# EAGLE design io_uarts (EAGLE 5.11)
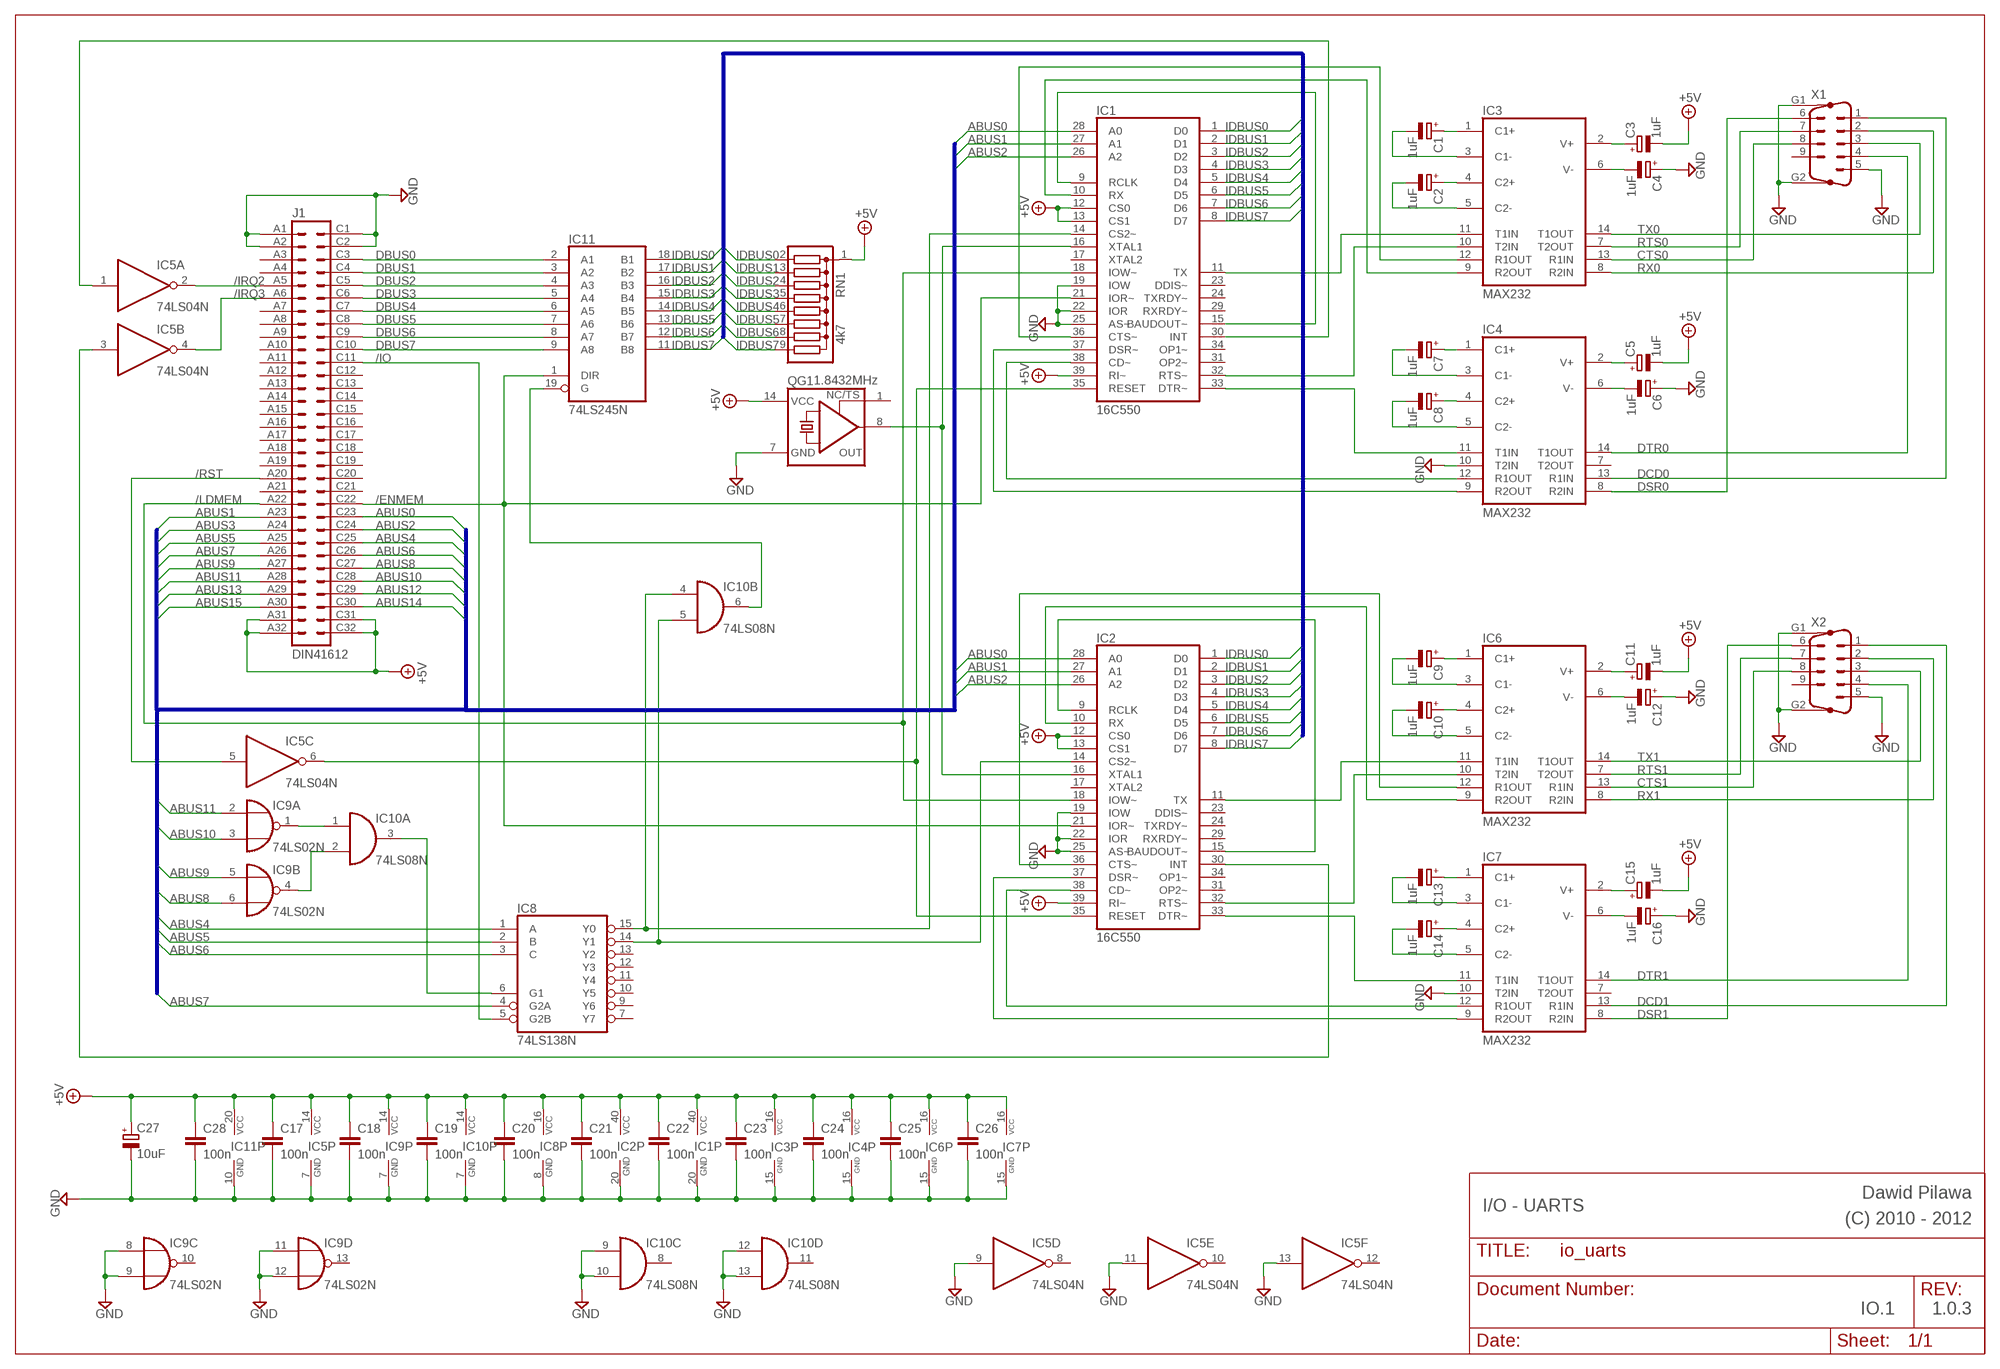
[diagram p0: schematic, sheet 1]

## Parts
C1  1uF  CPOL-EUE5-5  [E5-5]
C2  1uF  CPOL-EUE5-5  [E5-5]
C3  1uF  CPOL-EUE5-5  [E5-5]
C4  1uF  CPOL-EUE5-5  [E5-5]
C5  1uF  CPOL-EUE5-5  [E5-5]
C6  1uF  CPOL-EUE5-5  [E5-5]
C7  1uF  CPOL-EUE5-5  [E5-5]
C8  1uF  CPOL-EUE5-5  [E5-5]
C9  1uF  CPOL-EUE5-5  [E5-5]
C10  1uF  CPOL-EUE5-5  [E5-5]
C11  1uF  CPOL-EUE5-5  [E5-5]
C12  1uF  CPOL-EUE5-5  [E5-5]
C13  1uF  CPOL-EUE5-5  [E5-5]
C14  1uF  CPOL-EUE5-5  [E5-5]
C15  1uF  CPOL-EUE5-5  [E5-5]
C16  1uF  CPOL-EUE5-5  [E5-5]
C17  100n  C-EU050-024X044  [C050-024X044]
C18  100n  C-EU050-024X044  [C050-024X044]
C19  100n  C-EU050-024X044  [C050-024X044]
C20  100n  C-EU050-024X044  [C050-024X044]
C21  100n  C-EU050-024X044  [C050-024X044]
C22  100n  C-EU050-024X044  [C050-024X044]
C23  100n  C-EU050-024X044  [C050-024X044]
C24  100n  C-EU050-024X044  [C050-024X044]
C25  100n  C-EU050-024X044  [C050-024X044]
C26  100n  C-EU050-024X044  [C050-024X044]
C27  10uF  CPOL-EUE5-5  [E5-5]
C28  100n  C-EU050-024X044  [C050-024X044]
IC1  16C550  XR-16C550P  [DIL40]
IC2  16C550  XR-16C550P  [DIL40]
IC3  MAX232  [DIL16]
IC4  MAX232  [DIL16]
IC5  74LS04N  [DIL14]
IC6  MAX232  [DIL16]
IC7  MAX232  [DIL16]
IC8  74LS138N  [DIL16]
IC9  74LS02N  [DIL14]
IC10  74LS08N  [DIL14]
IC11  74LS245N  [DIL20]
J1  DIN41612  VG64B  [VG64B]
QG1  1.8432MHz  XO-14  [DIL14S]
RN1  4k7  G08R  [SIL9]
X1  M09HP  [M09HP]
X2  M09HP  [M09HP]

## Nets
+5V: C3.- C5.- C11.- C15.- C17.1 C18.1 C19.1 C20.1 C21.1 C22.1 C23.1 C24.1 C25.1 C26.1 C27.+ C28.1 IC1.12(CS0) IC1.13(CS1) IC1.39(RI~) IC1.40(VCC) IC2.12(CS0) IC2.13(CS1) IC2.39(RI~) IC2.40(VCC) IC3.16(VCC) IC4.16(VCC) IC5.14(P:VCC) IC6.16(VCC) IC7.16(VCC) IC8.16(VCC) IC9.14(P:VCC) IC10.14(P:VCC) IC11.20(VCC) J1.A31 J1.A32 J1.C31 J1.C32 QG1.14(VCC) RN1.1
/ENMEM: IC1.21(IOR~) IC2.21(IOR~) IC11.1(DIR) J1.C22
/IO: IC8.5(G2B) J1.C11
/IRQ2: IC5.2(A:O) J1.A5
/IRQ3: IC5.4(B:O) J1.A6
/LDMEM: IC1.18(IOW~) IC2.18(IOW~) J1.A22
/RST: IC5.5(C:I) J1.A20
ABUS0: IC1.28(A0) IC2.28(A0) J1.C23
ABUS1: IC1.27(A1) IC2.27(A1) J1.A23
ABUS2: IC1.26(A2) IC2.26(A2) J1.C24
ABUS3: J1.A24
ABUS4: IC8.1(A) J1.C25
ABUS5: IC8.2(B) J1.A25
ABUS6: IC8.3(C) J1.C26
ABUS7: IC8.4(G2A) J1.A26
ABUS8: IC9.6(B:I1) J1.C27
ABUS9: IC9.5(B:I0) J1.A27
ABUS10: IC9.3(A:I1) J1.C28
ABUS11: IC9.2(A:I0) J1.A28
ABUS12: J1.C29
ABUS13: J1.A29
ABUS14: J1.C30
ABUS15: J1.A30
CTS0: IC3.13(R1IN) X1.8
CTS1: IC6.13(R1IN) X2.8
DBUS0: IC11.2(A1) J1.C3
DBUS1: IC11.3(A2) J1.C4
DBUS2: IC11.4(A3) J1.C5
DBUS3: IC11.5(A4) J1.C6
DBUS4: IC11.6(A5) J1.C7
DBUS5: IC11.7(A6) J1.C8
DBUS6: IC11.8(A7) J1.C9
DBUS7: IC11.9(A8) J1.C10
DCD0: IC4.13(R1IN) X1.1
DCD1: IC7.13(R1IN) X2.1
DSR0: IC4.8(R2IN) X1.6
DSR1: IC7.8(R2IN) X2.6
DTR0: IC4.14(T1OUT) X1.4
DTR1: IC7.14(T1OUT) X2.4
GND: C4.+ C6.+ C12.+ C16.+ C17.2 C18.2 C19.2 C20.2 C21.2 C22.2 C23.2 C24.2 C25.2 C26.2 C27.- C28.2 IC1.19(IOW) IC1.20(GND) IC1.22(IOR) IC1.25(AS~) IC2.19(IOW) IC2.20(GND) IC2.22(IOR) IC2.25(AS~) IC3.15(GND) IC4.10(T2IN) IC4.15(GND) IC5.7(P:GND) IC5.9(D:I) IC5.11(E:I) IC5.13(F:I) IC6.15(GND) IC7.10(T2IN) IC7.15(GND) IC8.8(GND) IC9.7(P:GND) IC9.8(C:I0) IC9.9(C:I1) IC9.11(D:I0) IC9.12(D:I1) IC10.7(P:GND) IC10.9(C:I0) IC10.10(C:I1) IC10.12(D:I0) IC10.13(D:I1) IC11.10(GND) J1.A1 J1.A2 J1.C1 J1.C2 QG1.7(GND) X1.5 X1.G1 X1.G2 X2.5 X2.G1 X2.G2
IDBUS0: IC1.1(D0) IC2.1(D0) IC11.18(B1) RN1.2
IDBUS1: IC1.2(D1) IC2.2(D1) IC11.17(B2) RN1.3
IDBUS2: IC1.3(D2) IC2.3(D2) IC11.16(B3) RN1.4
IDBUS3: IC1.4(D3) IC2.4(D3) IC11.15(B4) RN1.5
IDBUS4: IC1.5(D4) IC2.5(D4) IC11.14(B5) RN1.6
IDBUS5: IC1.6(D5) IC2.6(D5) IC11.13(B6) RN1.7
IDBUS6: IC1.7(D6) IC2.7(D6) IC11.12(B7) RN1.8
IDBUS7: IC1.8(D7) IC2.8(D7) IC11.11(B8) RN1.9
N$1: IC1.11(TX) IC3.11(T1IN)
N$2: IC1.10(RX) IC3.9(R2OUT)
N$3: IC10.6(B:O) IC11.19(G)
N$4: IC1.32(RTS~) IC3.10(T2IN)
N$5: IC1.33(DTR~) IC4.11(T1IN)
N$6: IC1.36(CTS~) IC3.12(R1OUT)
N$7: IC1.38(CD~) IC4.12(R1OUT)
N$8: IC1.37(DSR~) IC4.9(R2OUT)
N$9: C1.- IC3.3(C1-)
N$10: C1.+ IC3.1(C1+)
N$11: C2.+ IC3.4(C2+)
N$12: C2.- IC3.5(C2-)
N$13: C4.- IC3.6(V-)
N$14: C3.+ IC3.2(V+)
N$15: IC1.9(RCLK) IC1.15(BAUDOUT~)
N$16: C6.- IC4.6(V-)
N$17: C5.+ IC4.2(V+)
N$18: C7.- IC4.3(C1-)
N$19: C7.+ IC4.1(C1+)
N$20: C8.+ IC4.4(C2+)
N$21: C8.- IC4.5(C2-)
N$22: IC9.1(A:O) IC10.1(A:I0)
N$23: C9.- IC6.3(C1-)
N$24: IC1.30(INT) IC5.1(A:I)
N$25: IC2.30(INT) IC5.3(B:I)
N$26: IC9.4(B:O) IC10.2(A:I1)
N$27: IC8.6(G1) IC10.3(A:O)
N$28: IC1.14(CS2~) IC8.15(Y0) IC10.4(B:I0)
N$29: IC2.14(CS2~) IC8.14(Y1) IC10.5(B:I1)
N$30: IC2.9(RCLK) IC2.15(BAUDOUT~)
N$31: IC2.11(TX) IC6.11(T1IN)
N$32: IC2.32(RTS~) IC6.10(T2IN)
N$33: IC2.33(DTR~) IC7.11(T1IN)
N$34: IC2.38(CD~) IC7.12(R1OUT)
N$35: IC2.37(DSR~) IC7.9(R2OUT)
N$36: IC2.10(RX) IC6.9(R2OUT)
N$37: IC2.36(CTS~) IC6.12(R1OUT)
N$38: C9.+ IC6.1(C1+)
N$39: IC1.35(RESET) IC2.35(RESET) IC5.6(C:O)
N$40: C10.+ IC6.4(C2+)
N$41: C10.- IC6.5(C2-)
N$42: C12.- IC6.6(V-)
N$43: C11.+ IC6.2(V+)
N$44: C13.- IC7.3(C1-)
N$45: C13.+ IC7.1(C1+)
N$46: C14.+ IC7.4(C2+)
N$47: C14.- IC7.5(C2-)
N$48: C16.- IC7.6(V-)
N$49: C15.+ IC7.2(V+)
N$50: IC1.16(XTAL1) IC2.16(XTAL1) QG1.8(OUT)
RTS0: IC3.7(T2OUT) X1.7
RTS1: IC6.7(T2OUT) X2.7
RX0: IC3.8(R2IN) X1.2
RX1: IC6.8(R2IN) X2.2
TX0: IC3.14(T1OUT) X1.3
TX1: IC6.14(T1OUT) X2.3
Unconnected: IC1.17(XTAL2) IC1.23(DDIS~) IC1.24(TXRDY~) IC1.29(RXRDY~) IC1.31(OP2~) IC1.34(OP1~) IC2.17(XTAL2) IC2.23(DDIS~) IC2.24(TXRDY~) IC2.29(RXRDY~) IC2.31(OP2~) IC2.34(OP1~) IC4.7(T2OUT) IC5.8(D:O) IC5.10(E:O) IC5.12(F:O) IC7.7(T2OUT) IC8.7(Y7) IC8.9(Y6) IC8.10(Y5) IC8.11(Y4) IC8.12(Y3) IC8.13(Y2) IC9.10(C:O) IC9.13(D:O) IC10.8(C:O) IC10.11(D:O) J1.A3 J1.A4 J1.A7 J1.A8 J1.A9 J1.A10 J1.A11 J1.A12 J1.A13 J1.A14 J1.A15 J1.A16 J1.A17 J1.A18 J1.A19 J1.A21 J1.C12 J1.C13 J1.C14 J1.C15 J1.C16 J1.C17 J1.C18 J1.C19 J1.C20 J1.C21 QG1.1(TS) X1.9 X2.9

## Buses
ABUS[0..15]
IDBUS[0..7]

## Notes on the sheet
- Dawid Pilawa
- I/O - UARTS | (C) 2010 - 2012
- IO.1 | 1.0.3

## Library data of the parts
C1-C16 C27 = rcl:CPOL-EU: POLARIZED CAPACITOR, European symbol
C17-C26 C28 = rcl:C-EU: CAPACITOR, European symbol
IC1 IC2 = exar:XR-16C550P: UART/FIFO
IC3 IC4 IC6 IC7 = maxim:MAX232: RS232 TRANSEIVER
IC5 = 74xx-eu:74*04: Hex INVERTER
IC8 = 74xx-eu:74*138: 3-line to 8-line DECODER/DEMULTIPLEXER
IC9 = 74xx-eu:74*02: Quad 2-input NOR gate
IC10 = 74xx-eu:74*08: Quad 2-input AND gate
IC11 = 74xx-eu:74*245: Octal BUS TRANSCEIVER, 3-state
J1 = 19inch:VG64: PCB EUROCARD, 64-pin type C/AC, 2.54 mm
QG1 = crystal:XO-: CRYSTAL
RN1 = resistor-sil:G08R: SIL RESISTOR
X1 X2 = con-subd:M09HP: SUB-D; OC_FARNELL: unknown; OC_NEWARK: unknown

## Board
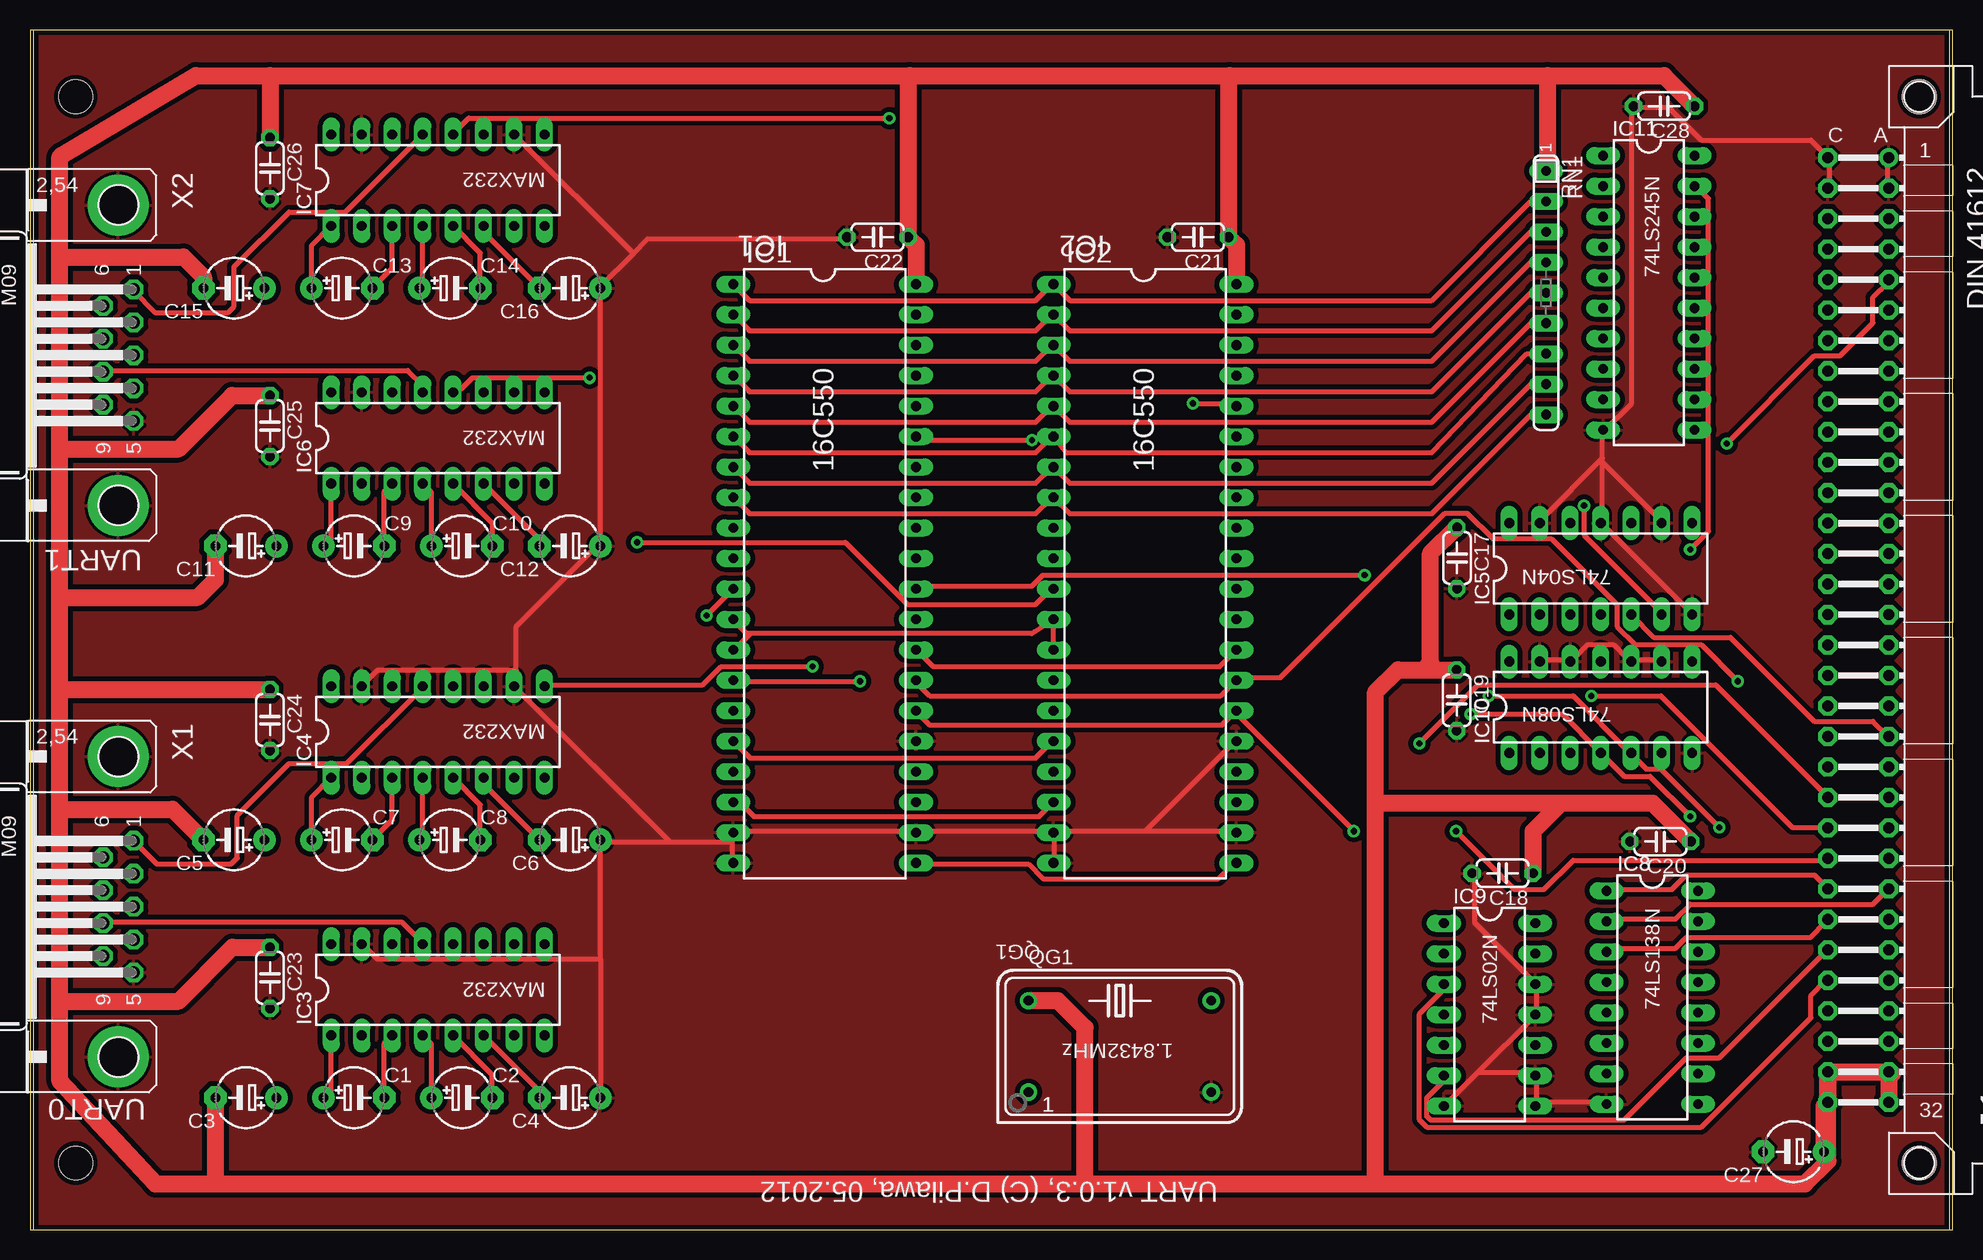
[diagram p1: board, top side]
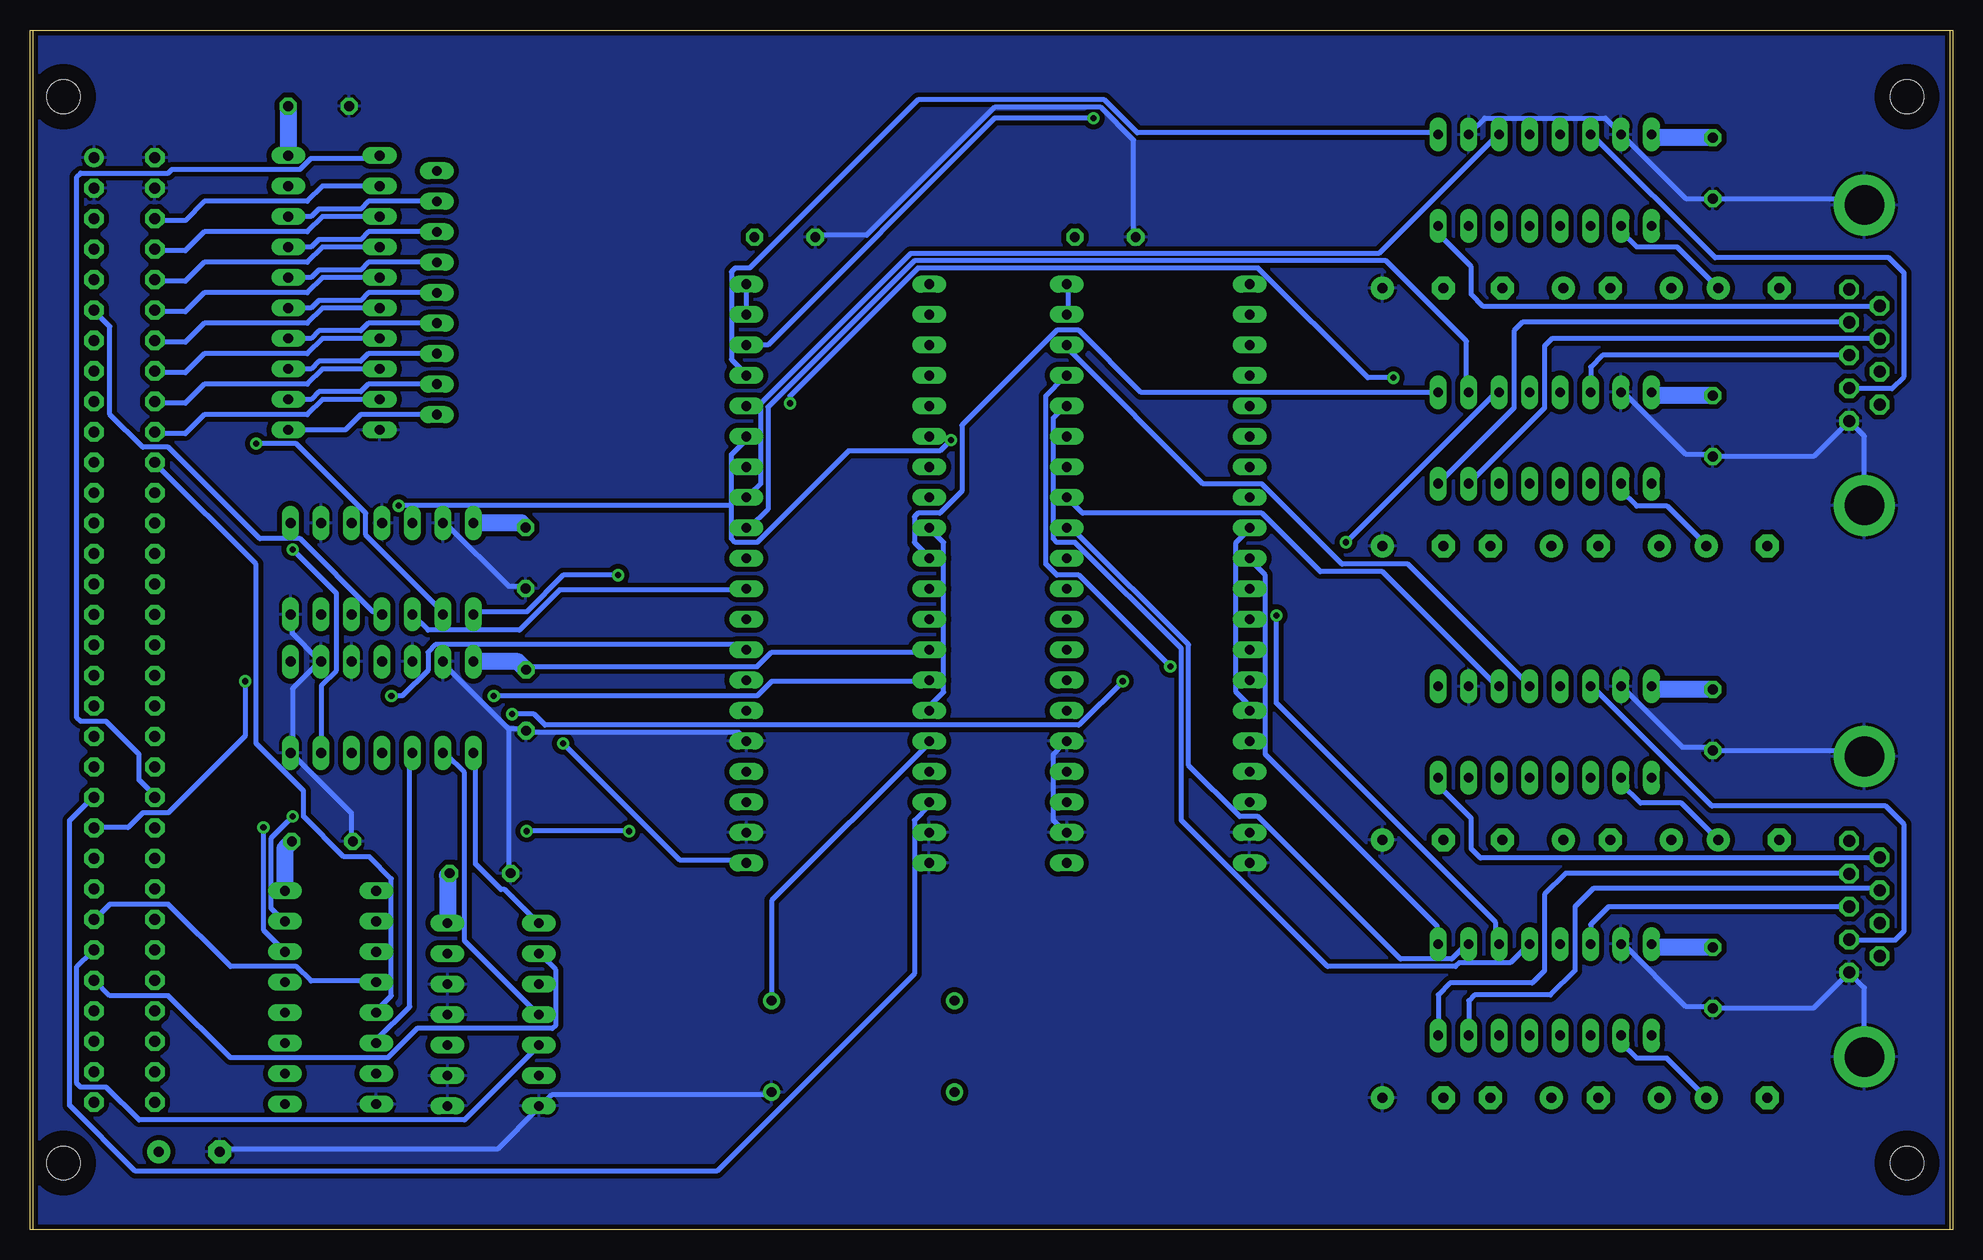
[diagram p2: board, bottom side, seen from below]

Size 160 x 100 mm. Coordinates in mm from the lower left corner, seen from the top.
Outline: 0,0 160,0 160,100 0,100 0,0
Copper layers (1*16): Top 0.035mm / dielectric 1.5mm / Bottom 0.035mm
Design rules "SparkFun_squarepads": minimum track width 8mil, minimum drill 20mil, track to track 8mil, track to pad 8mil, pad to pad 8mil, via to via 8mil, smd to smd 8mil, copper to edge 10mil, drill to drill 8mil, minimum pad ring 12mil, minimum via ring 10mil, stop-mask expansion 4mil, vias tented up to drill 25mil, thermal gap 10mil

### Footprints (pad centres in the part's own frame; a part is rotated, then mirrored left to right if it is on the bottom)
E5-5 = drill 0.813 pad 1.905 round: + -2.54,0 | drill 0.813 pad 1.905 octagon: - 2.54,0
C050-024X044 = drill 0.813 octagon: 1 -2.54,0; 2 2.54,0
DIL40 = drill 0.813 long: 1 -24.13,-7.62; 2 -21.59,-7.62; 3 -19.05,-7.62; 4 -16.51,-7.62; 5 -13.97,-7.62; 6 -11.43,-7.62; 7 -8.89,-7.62; 8 -6.35,-7.62; 9 -3.81,-7.62; 10 -1.27,-7.62; 11 1.27,-7.62; 12 3.81,-7.62; 13 6.35,-7.62; 14 8.89,-7.62; 15 11.43,-7.62; 16 13.97,-7.62; 17 16.51,-7.62; 18 19.05,-7.62; 19 21.59,-7.62; 20 24.13,-7.62; 21 24.13,7.62; 22 21.59,7.62; 23 19.05,7.62; 24 16.51,7.62; 25 13.97,7.62; 26 11.43,7.62; 27 8.89,7.62; 28 6.35,7.62; 29 3.81,7.62; 30 1.27,7.62; 31 -1.27,7.62; 32 -3.81,7.62; 33 -6.35,7.62; 34 -8.89,7.62; 35 -11.43,7.62; 36 -13.97,7.62; 37 -16.51,7.62; 38 -19.05,7.62; 39 -21.59,7.62; 40 -24.13,7.62
DIL16 = drill 0.813 long: 1 -8.89,-3.81; 2 -6.35,-3.81; 3 -3.81,-3.81; 4 -1.27,-3.81; 5 1.27,-3.81; 6 3.81,-3.81; 7 6.35,-3.81; 8 8.89,-3.81; 9 8.89,3.81; 10 6.35,3.81; 11 3.81,3.81; 12 1.27,3.81; 13 -1.27,3.81; 14 -3.81,3.81; 15 -6.35,3.81; 16 -8.89,3.81
DIL14 = drill 0.813 long: 1 -7.62,-3.81; 2 -5.08,-3.81; 3 -2.54,-3.81; 4 0,-3.81; 5 2.54,-3.81; 6 5.08,-3.81; 7 7.62,-3.81; 8 7.62,3.81; 9 5.08,3.81; 10 2.54,3.81; 11 0,3.81; 12 -2.54,3.81; 13 -5.08,3.81; 14 -7.62,3.81
DIL20 = drill 0.813 long: 1 -11.43,-3.81; 2 -8.89,-3.81; 3 -6.35,-3.81; 4 -3.81,-3.81; 5 -1.27,-3.81; 6 1.27,-3.81; 7 3.81,-3.81; 8 6.35,-3.81; 9 8.89,-3.81; 10 11.43,-3.81; 11 11.43,3.81; 12 8.89,3.81; 13 6.35,3.81; 14 3.81,3.81; 15 1.27,3.81; 16 -1.27,3.81; 17 -3.81,3.81; 18 -6.35,3.81; 19 -8.89,3.81; 20 -11.43,3.81
VG64B = drill 0.914 pad 1.6 round: A1 154.94,39.37 | drill 0.914 pad 1.6 octagon: A2 154.94,36.83; A3 154.94,34.29; A4 154.94,31.75; A5 154.94,29.21; A6 154.94,26.67; A7 154.94,24.13; A8 154.94,21.59; A9 154.94,19.05; A10 154.94,16.51; A11 154.94,13.97; A12 154.94,11.43; A13 154.94,8.89; A14 154.94,6.35; A15 154.94,3.81; A16 154.94,1.27; A17 154.94,-1.27; A18 154.94,-3.81; A19 154.94,-6.35; A20 154.94,-8.89; A21 154.94,-11.43; A22 154.94,-13.97; A23 154.94,-16.51; A24 154.94,-19.05; A25 154.94,-21.59; A26 154.94,-24.13; A27 154.94,-26.67; A28 154.94,-29.21; A29 154.94,-31.75; A30 154.94,-34.29; A31 154.94,-36.83; A32 154.94,-39.37; C1 149.86,39.37; C2 149.86,36.83; C3 149.86,34.29; C4 149.86,31.75; C5 149.86,29.21; C6 149.86,26.67; C7 149.86,24.13; C8 149.86,21.59; C9 149.86,19.05; C10 149.86,16.51; C11 149.86,13.97; C12 149.86,11.43; C13 149.86,8.89; C14 149.86,6.35; C15 149.86,3.81; C16 149.86,1.27; C17 149.86,-1.27; C18 149.86,-3.81; C19 149.86,-6.35; C20 149.86,-8.89; C21 149.86,-11.43; C22 149.86,-13.97; C23 149.86,-16.51; C24 149.86,-19.05; C25 149.86,-21.59; C26 149.86,-24.13; C27 149.86,-26.67; C28 149.86,-29.21; C29 149.86,-31.75; C30 149.86,-34.29; C31 149.86,-36.83; C32 149.86,-39.37 | hole 2.794: 157.48,44.45; 157.48,-44.45; 3.81,-44.45; 3.81,44.45
DIL14S = drill 0.813 round: 1 -7.62,-3.81; 7 7.62,-3.81; 8 7.62,3.81; 14 -7.62,3.81
SIL9 = drill 0.813 long: 1 -10.16,0; 2 -7.62,0; 3 -5.08,0; 4 -2.54,0; 5 0,0; 6 2.54,0; 7 5.08,0; 8 7.62,0; 9 10.16,0
M09HP = drill 1.016 octagon: 1 -5.486,1.27; 2 -2.743,1.27; 3 0,1.27; 4 2.743,1.27; 5 5.486,1.27; 6 -4.115,-1.27; 7 -1.372,-1.27; 8 1.372,-1.27; 9 4.115,-1.27 | drill 3.302 pad 5.08 round: G1 -12.522,0; G2 12.522,0

### Placement (x,y rotation side)
C1  27,11 0 top
C2  36,11 0 top
C3  18,11 180 top
C4  45,11 180 top
C5  17,32.49 180 top
C6  45,32.49 180 top
C7  26,32.49 0 top
C8  35,32.49 0 top
C9  27,57 0 top
C10  36,57 0 top
C11  18,57 180 top
C12  45,57 180 top
C13  26,78.49 0 top
C14  35,78.49 0 top
C15  17,78.49 180 top
C16  45,78.49 180 top
C17  118.95,56 270 top
C18  122.75,29.71 180 top
C19  118.92,44.14 270 top
C20  135.91,32.36 180 top
C21  97.36,82.74 180 top
C22  70.65,82.74 180 top
C23  20,21 270 top
C24  20,42.49 270 top
C25  20,67 270 top
C26  20,88.49 270 top
C27  147,6.5 180 top
C28  136.21,93.66 180 top
IC1  66.23,54.7 270 top
IC2  92.94,54.7 270 top
IC3  34,20 0 top
IC4  34,41.49 0 top
IC5  130.93,55.1 0 top
IC6  34,66 0 top
IC7  34,87.49 0 top
IC8  135.22,19.36 270 top
IC9  121.67,17.93 270 top
IC10  130.93,43.55 0 top
IC11  134.94,78.11 270 top
J1  0,50 0 top
QG1  90.84,15.28 0 top
RN1  126.36,78.11 270 top
X1  7.37,26.92 270 top
X2  7.37,72.9 270 top

### Tracks (layer width: path | path; a pad name or v marks a point on that pad's centre or on a via)
+5V
  Top 0.406: IC1.12 58.62,50.81 59.74,49.68 60.05,49.68 | 60.05,49.68 83.51,49.68 83.72,49.83 IC2.12 IC2.13 | 60.05,49.68 58.83,48.46 IC1.13
  Top 1.422: J1.C31 J1.C32 149.54,10.31 C27.+ | J1.C31 J1.A31 155.09,13.02 155.26,13.02 154.94,12.7 J1.A32 | J1.C31 149.86,5.71 147.96,3.81 112.47,3.81 | 15.56,3.81 10.48,3.81 2.49,12.41 2.49,18.9 | 15.56,3.81 88.27,3.81 | 88.27,3.81 112.47,3.81 | 20,96.2 13.83,96.2 2.62,89.54 | 20,96.2 73.34,96.2 | 73.34,96.2 100.01,96.2 | 100.01,96.2 126.49,96.2 | 126.49,96.2 136.21,96.2 C28.1 | C18.1 125.29,33.21 127.64,35.56 | 127.64,35.56 135.24,35.56 C20.1 | 100.01,96.2 99.89,96.08 C21.1 100.56,82.08 IC2.40 | 73.34,96.2 73.19,96.05 C22.1 73.86,82.08 IC1.40 | QG1.14 85.69,19.09 87.95,16.83 87.95,4.13 88.27,3.81 | C26.1 20,96.2 | C3.- 15.46,3.91 15.56,3.81 | C11.- 15.46,54.2 13.97,52.7 2.49,52.7 | 14.46,78.57 C15.- 14.46,79.42 12.8,81.08 2.79,81.08 2.49,80.77 | C25.1 16.84,69.54 12.38,65.09 2.49,65.09 | C23.1 16.87,23.54 12.38,19.05 2.64,19.05 2.49,18.9 | 14.46,32.53 C5.- 14.45,32.49 11.89,35.05 2.79,35.05 2.49,34.75 | C17.1 118.89,58.54 116.74,56.39 116.74,47.28 116.13,46.67 | 2.62,89.54 2.49,89.43 | 2.49,18.9 2.49,34.75 | 2.49,34.75 2.49,45.11 | 2.49,45.11 2.49,52.7 | 2.49,65.09 2.49,80.77 | 2.49,80.77 2.49,89.41 2.62,89.54 | C24.1 2.57,45.03 2.49,45.11 | 2.49,52.7 2.49,65.09 | RN1.1 126.49,88.27 126.49,96.2 | 116.13,46.67 114.04,46.67 112.17,44.81 112.17,35.97 | 116.13,46.67 C19.1 | 112.17,35.97 112.17,4.12 112.47,3.81 | 127.64,35.56 112.57,35.56 112.17,35.97
  Bottom 0.406: IC1.39 73.76,76.5 73.76,78.64 IC1.40 | IC2.39 100.58,76.5 100.58,78.64 IC2.40 | IC2.13 85.34,48.16 98.45,48.16 99.67,46.94 118.26,46.94 C19.1
  Bottom 1.422: C19.1 119.61,47.36 IC10.14 | IC9.14 125.47,29.53 C18.1 | IC8.16 139.03,31.77 C20.1 | C28.1 IC11.20 | C26.1 24.84,91.03 IC7.16 | C25.1 24.84,69.54 IC6.16 | C24.1 24.84,45.03 IC4.16 | C23.1 24.84,23.54 IC3.16 | IC5.14 119.32,58.91 C17.1
/ENMEM  (via drill 0.51)
  Top 0.406: IC1.21 74.07,30.48 83.21,30.48 84.43,29.26 99.06,29.26 100.28,30.48 IC2.21 | v115.82,40.54 120.7,45.41 140.51,45.41 149.66,36.27 J1.C22
  Bottom 0.406: IC11.1 131.37,89.31 136.85,89.31 137.77,88.39 148.44,88.39 148.74,88.09 156.06,88.09 156.36,87.78 156.36,42.67 156.06,42.37 153.92,42.37 151.18,39.62 151.18,37.49 149.96,36.27 J1.C22 | v115.82,40.54 106.07,30.79 100.58,30.79 IC2.21
/IO
  Bottom 0.406: IC8.5 131.37,18.29 130.15,19.51 130.15,29.26 131.98,31.09 134.11,31.09 137.47,34.44 137.47,36.58 141.43,40.54 141.43,55.47 149.66,63.7 J1.C11
/IRQ2  (via drill 0.51)
  Top 0.406: v141.43,65.53 148.74,72.85 150.88,72.85 153.62,75.59 153.62,77.72 154.84,78.94 J1.A5
  Bottom 0.406: v141.43,65.53 138.07,65.53 132.28,59.74 132.28,57.91 125.88,51.51 IC5.2
/IRQ3
  Bottom 0.406: IC5.4 131.06,51.51 131.67,51.51 137.77,57.61 141.12,57.61 148.74,65.23 150.88,65.23 153.62,67.97 153.62,75.29 154.84,76.5 J1.A6
/LDMEM
  Top 0.406: IC1.18 59.15,35.65 60.35,34.44 84.12,34.44 IC2.18
  Bottom 0.406: J1.A22 155.14,35.97 156.97,34.14 156.97,10.36 151.49,4.88 103.02,4.88 86.56,21.34 86.56,34.14 85.34,35.36 IC2.18
/RST
  Top 0.406: IC5.5 133.5,51.21 135.33,49.38 141.73,49.38 148.74,42.37 153.62,42.37 154.84,41.15 J1.A20
ABUS0  (via drill 0.51)
  Top 0.406: IC1.28 73.88,48.34 75.29,46.94 99.16,46.94 IC2.28 | v130.15,44.5 135.94,44.5 146.91,33.53 149.66,33.53 J1.C23
  Bottom 0.406: v130.15,44.5 129.24,44.5 127.1,46.63 127.1,48.16 126.49,48.77 100.89,48.77 100.58,48.46 IC2.28
ABUS1  (via drill 0.51)
  Top 0.406: IC1.27 73.86,45.63 74.98,44.5 99.26,44.5 IC2.27 100.58,46.02 104.24,46.02 117.96,59.74 119.79,59.74 121.92,57.61 126.8,57.61 132.28,52.12 132.28,50.29 133.81,48.77 139.29,48.77 v142.34,45.72
  Bottom 0.406: v142.34,45.72 142.34,41.15 148.74,34.75 150.88,34.75 152.09,33.53 154.84,33.53 J1.A23
ABUS2  (via drill 0.51)
  Top 0.406: IC1.26 73.86,43.19 74.98,42.06 99.36,42.06 IC2.26 100.58,42.98 v110.34,33.22 | v118.87,33.22 123.75,28.35 126.19,28.35 128.63,30.79 149.66,30.79 J1.C24
  Bottom 0.406: v110.34,33.22 v118.87,33.22
ABUS4
  Top 0.406: IC8.1 131.67,28.35 136.85,28.35 138.07,29.57 148.74,29.57 149.66,28.65 J1.C25
ABUS5
  Top 0.406: IC8.2 131.67,25.91 137.16,25.91 138.38,27.13 153.62,27.13 154.84,28.35 J1.A25
ABUS6
  Top 0.406: IC8.3 131.67,23.47 137.16,23.47 138.07,24.38 148.44,24.38 149.66,25.6 J1.C26
ABUS7
  Bottom 0.406: IC8.4 131.67,20.73 136.85,20.73 138.07,21.95 143.56,21.95 148.74,27.13 153.62,27.13 154.84,25.91 J1.A26
ABUS8
  Top 0.406: IC9.6 117.65,12.8 117.65,12.19 116.43,10.97 116.43,9.45 116.74,9.14 132.89,9.14 138.07,14.33 140.82,14.33 149.66,23.16 J1.C27
ABUS9
  Bottom 0.406: IC9.5 117.96,15.24 124.05,9.14 151.18,9.14 153.92,11.89 156.06,11.89 156.36,12.19 156.36,21.95 155.14,23.16 J1.A27
ABUS10
  Top 0.406: IC9.3 117.65,20.42 117.65,19.81 115.82,17.98 115.82,9.14 116.43,8.53 139.29,8.53 148.44,17.68 148.44,19.51 149.66,20.73 J1.C28
ABUS11
  Bottom 0.406: IC9.2 117.65,22.86 116.43,21.64 116.43,17.07 116.74,16.76 128.02,16.76 130.45,14.33 143.56,14.33 148.74,19.51 153.62,19.51 154.84,20.73 J1.A28
CTS0
  Top 0.406: IC3.13 32.73,23.91 30.99,25.65 6.2,25.65 X1.8
CTS1
  Top 0.406: IC6.13 32.73,70.39 31.5,71.63 6.2,71.63 X2.8
DBUS0
  Bottom 0.406: IC11.2 135.89,87 137.16,85.72 145.73,85.72 147.32,84.14 149.86,84.14 J1.C3
DBUS1
  Bottom 0.406: IC11.3 135.89,84.45 137.16,83.19 145.73,83.19 147.32,81.6 149.86,81.6 J1.C4
DBUS2
  Bottom 0.406: IC11.4 135.89,81.92 137.16,80.64 145.73,80.64 147.32,79.06 149.86,79.06 J1.C5
DBUS3
  Bottom 0.406: IC11.5 135.89,79.38 137.16,78.11 145.73,78.11 147.32,76.52 149.86,76.52 J1.C6
DBUS4
  Bottom 0.406: IC11.6 135.89,76.83 137.16,75.56 145.73,75.56 147.32,73.98 149.86,73.98 J1.C7
DBUS5
  Bottom 0.406: IC11.7 135.89,74.3 137.16,73.03 145.73,73.03 147.32,71.44 149.86,71.44 J1.C8
DBUS6
  Bottom 0.406: IC11.8 135.89,71.75 137.16,70.48 145.73,70.48 147.32,68.9 149.86,68.9 J1.C9
DBUS7
  Bottom 0.406: IC11.9 135.89,69.22 137.16,67.94 145.73,67.94 147.32,66.36 149.86,66.36 J1.C10
DCD0
  Top 0.406: IC4.13 32.73,45.18 26.42,38.86 21.59,38.86 17.27,34.54 17.27,30.99 16.76,30.48 10.57,30.48 X1.1
DCD1
  Top 0.406: IC7.13 26.26,84.84 21.59,84.84 17.02,80.26 17.02,76.96 16.51,76.45 10.41,76.45 8.64,78.23 X2.1
DSR0
  Bottom 0.406: IC4.8 42.89,37.05 40.13,34.29 40.13,31.75 39.37,30.99 6.15,30.99 X1.6
DSR1
  Bottom 0.406: IC7.8 42.89,83.02 40.13,80.26 40.13,77.98 39.12,76.96 6.15,76.96 X2.6
DTR0
  Bottom 0.406: IC4.14 30.06,45.3 20.07,35.31 5.59,35.31 4.06,33.78 4.06,24.89 4.83,24.13 8.59,24.13 X1.4
DTR1
  Bottom 0.406: IC7.14 30.09,91.3 19.81,81.03 5.33,81.03 4.06,79.76 4.06,71.12 5.08,70.1 8.59,70.1 X2.4
GND
  Top 0.406: 125.58,10.67 125.58,12.8 IC9.9 125.27,13.11 120.7,13.11 | 125.58,10.67 125.58,10.36 IC9.8 125.58,10.67 | 125.58,10.67 131.37,10.67 IC8.8 | 120.7,13.11 117.96,10.36 IC9.7 | 120.7,13.11 125.27,17.68 IC9.11 125.58,17.98 125.58,20.42 IC9.12 125.27,20.73 120.4,25.6 120.4,29.57 C18.2 | 154.84,86.87 154.84,89.31 J1.A1 | 149.96,86.87 149.96,89.31 J1.C1 149.66,89.61 148.44,90.83 139.29,90.83 136.55,93.57 133.81,93.57 C28.2 133.5,93.57 133.5,68.89 131.37,66.75 IC11.10 131.06,66.45 131.06,64.31 | 149.96,86.87 154.84,86.87 | 154.84,86.87 J1.A2 | 149.96,86.87 J1.C2 | IC10.13 125.88,47.55 128.32,47.55 IC10.12 128.63,47.55 129.84,48.77 131.98,48.77 133.2,47.55 IC10.10 133.5,47.55 135.94,47.55 IC10.9 | 131.06,64.01 131.06,64.31 | 131.06,64.01 131.06,59.13 IC5.11 131.06,58.83 138.38,51.51 IC5.7 | 131.06,64.01 135.94,59.13 IC5.9 | 131.06,64.31 125.88,59.13 IC5.13 | 50.29,81.38 47.55,78.64 C16.+ 47.55,78.33 47.55,57.3 C12.+ 47.24,57 40.54,50.29 40.54,46.63 | 50.29,81.38 51.51,82.6 67.97,82.6 C22.2 | 50.29,81.38 40.54,91.14 IC7.10 | 40.54,46.63 40.54,45.41 IC4.10 40.54,45.11 53.34,32.31 | 40.54,46.63 28.96,46.63 27.74,45.41 IC4.15 | 58.52,32.31 58.52,32.92 IC1.19 58.83,33.22 73.76,33.22 IC1.22 74.07,33.22 85.04,33.22 IC2.19 | 58.52,32.31 58.52,30.79 IC1.20 | 47.55,32.31 53.34,32.31 | 53.34,32.31 58.52,32.31 | 47.55,22.55 47.55,32.31 | 47.55,22.55 47.55,11.28 C4.+ | 47.55,32.31 C6.+ | IC2.20 85.34,30.79 85.34,32.92 IC2.19 | 92.96,33.22 85.34,33.22 IC2.19 | 92.96,33.22 100.28,33.22 IC2.22 | 92.96,33.22 100.28,40.54 IC2.25 | 47.55,22.55 28.96,22.55 27.74,23.77 IC3.15
  Bottom 0.406: QG1.7 98.75,11.28 116.74,11.28 117.65,10.36 IC9.7 117.96,10.06 121.31,6.71 144.17,6.71 C27.- | 120.4,41.76 119.18,41.76 C19.2 118.87,41.45 101.19,41.45 100.58,40.84 IC2.25 | 120.4,41.76 125.88,47.24 IC10.13 | 120.4,41.76 120.4,29.87 C18.2 | C20.2 133.5,32.61 133.5,34.75 138.38,39.62 IC10.7 138.38,39.93 138.38,45.11 136.25,47.24 IC10.9 136.25,47.55 138.38,49.68 138.38,51.21 IC5.7 | C17.2 119.18,53.65 120.4,53.65 125.58,58.83 IC5.13 | C21.2 94.79,82.91 90.53,82.91 79.86,93.57 71.02,93.57 68.28,90.83 68.28,82.91 C22.2 | IC7.10 40.23,91.44 39.01,92.66 28.96,92.66 27.74,91.44 IC7.15 27.43,91.14 22.25,85.95 20.12,85.95 C26.2 7.9,85.95 X2.G1 | IC6.15 27.43,69.8 22.25,64.62 20.12,64.62 C25.2 11.59,64.46 X2.5 7.37,66.14 X2.G2 | IC4.15 27.43,45.11 22.55,40.23 20.12,40.23 C24.2 7.87,39.95 X1.G1 | IC3.15 27.43,23.77 22.25,18.59 20.12,18.59 C23.2 11.61,18.46 X1.5 7.37,20.17 X1.G2 | IC1.25 74.07,40.54 74.98,39.62 74.98,34.14 74.07,33.22 IC1.22
  pour Top (isolate 0.406): 0,99.97 160.32,99.97 160.32,0 0,0
  pour Bottom (isolate 0.406): 0,99.97 160.32,99.97 160.32,0 0,0
IDBUS0
  Top 0.406: IC1.1 59.97,77.47 83.82,77.47 85.17,78.83 IC2.1 86.68,77.47 116.84,77.47 125.09,85.72 RN1.2
  Bottom 0.406: IC11.18 136.84,84.45 136.21,85.09 132.7,85.09 132.07,85.72 RN1.2
IDBUS1
  Top 0.406: IC1.2 59.97,74.93 83.82,74.93 85.17,76.28 IC2.2 86.68,74.93 116.84,74.93 125.09,83.19 RN1.3
  Bottom 0.406: IC11.17 136.84,81.92 136.21,82.55 132.7,82.55 132.07,83.19 RN1.3
IDBUS2
  Top 0.406: IC1.3 59.97,72.39 83.82,72.39 85.17,73.75 IC2.3 86.68,72.39 116.84,72.39 125.09,80.64 RN1.4
  Bottom 0.406: IC11.16 136.84,79.38 136.21,80.01 132.7,80.01 132.07,80.64 RN1.4
IDBUS3
  Top 0.406: IC1.4 59.97,69.85 83.82,69.85 85.17,71.2 IC2.4 86.68,69.85 116.84,69.85 125.09,78.11 RN1.5
  Bottom 0.406: IC11.15 136.84,76.83 136.21,77.47 132.7,77.47 132.07,78.11 RN1.5
IDBUS4
  Top 0.406: IC1.5 59.97,67.31 83.82,67.31 85.17,68.67 IC2.5 86.68,67.31 116.84,67.31 125.09,75.56 RN1.6
  Bottom 0.406: IC11.14 136.84,74.3 136.21,74.93 132.7,74.93 132.07,75.56 RN1.6
IDBUS5
  Top 0.406: IC1.6 59.97,64.77 83.82,64.77 85.17,66.12 IC2.6 86.36,64.77 116.84,64.77 124.78,73.03 RN1.7
  Bottom 0.406: IC11.13 136.84,71.75 136.21,72.39 132.7,72.39 132.07,73.03 RN1.7
IDBUS6
  Top 0.406: IC1.7 59.97,62.23 83.82,62.23 85.17,63.59 IC2.7 86.68,62.23 116.84,62.23 125.09,70.48 RN1.8
  Bottom 0.406: IC11.12 136.84,69.22 136.21,69.85 132.7,69.85 132.07,70.48 RN1.8
IDBUS7
  Top 0.406: IC1.8 59.97,59.69 83.82,59.69 85.17,61.05 IC2.8 86.68,59.69 116.84,59.69 125.09,67.94 RN1.9
  Bottom 0.406: IC11.11 133.99,66.67 132.72,67.94 RN1.9
N$1  (via drill 0.51)
  Top 0.406: v56.39,51.21 58.52,53.34 IC1.11
  Bottom 0.406: v56.39,51.21 56.39,43.89 38.1,25.6 38.1,24.08 IC3.11
N$2
  Bottom 0.406: IC3.9 42.98,24.08 42.98,25.3 57.3,39.62 57.3,54.56 58.52,55.78 IC1.10
N$3  (via drill 0.51)
  Top 0.406: v138.38,56.69 139.9,58.22 139.9,85.95 138.99,86.87 IC11.19
  Bottom 0.406: v138.38,56.69 134.72,53.03 134.72,46.63 135.94,45.41 135.94,39.93 IC10.6
N$4
  Bottom 0.406: IC3.10 40.54,23.77 41.76,22.55 46.02,22.55 57.91,34.44 59.44,34.44 63.7,38.71 63.7,48.77 73.15,58.22 73.76,58.22 IC1.32
N$5
  Bottom 0.406: IC4.11 38.1,45.41 47.55,54.86 52.73,54.86 57.61,59.74 72.54,59.74 73.76,60.96 IC1.33
N$6
  Bottom 0.406: IC3.12 35.36,23.77 36.88,22.25 41.15,22.25 41.45,21.95 52.12,21.95 64.31,34.14 64.31,48.46 73.15,57.3 74.68,57.3 74.98,57.61 74.98,67.67 74.07,68.58 IC1.36
N$7
  Bottom 0.406: IC4.12 35.36,45.41 45.41,55.47 50.9,55.47 57.61,62.18 62.48,62.18 73.76,73.46 IC1.38
N$8  (via drill 0.51)
  Top 0.406: v65.23,46.94 57.61,46.94 56.08,45.41 42.98,45.41 IC4.9
  Bottom 0.406: v65.23,46.94 72.85,54.56 74.68,54.56 75.59,55.47 75.59,69.49 74.07,71.02 IC1.37
N$9
  Top 0.406: C1.- 29.54,15.54 IC3.3
N$10
  Top 0.406: C1.+ 25.11,11.65 IC3.1
N$11
  Top 0.406: C2.+ 33.46,15.46 IC3.4
N$12
  Top 0.406: C2.- 38.54,12.92 IC3.5
N$13
  Top 0.406: C4.- 42.46,11.54 IC3.6
N$14
  Bottom 0.406: C3.+ 23.83,14.29 26.35,14.29 27.65,15.59 IC3.2
N$15
  Bottom 0.406: IC1.15 58.83,43.28 58.83,43.89 59.74,44.81 59.74,57.3 58.83,58.22 IC1.9
N$16
  Top 0.406: C6.- 37.81,37.14 IC4.6
N$17
  Bottom 0.406: C5.+ 22.61,35.56 26.04,35.56 27.65,37.17 IC4.2
N$18
  Top 0.406: C7.- 30.19,34.14 IC4.3
N$19
  Top 0.406: C7.+ 23.46,36.03 IC4.1
N$20
  Top 0.406: C8.+ 32.73,32.76 IC4.4
N$21
  Top 0.406: IC4.5 37.54,35.41 C8.-
N$22
  Bottom 0.406: IC9.1 117.96,25.6 120.7,28.35 121.01,28.35 123.14,30.48 123.14,39.62 IC10.1
N$23
  Top 0.406: IC6.3 29.54,61.54 C9.-
N$24  (via drill 0.51)
  Top 0.406: v111.25,54.56 84.43,54.56 83.52,53.65 74.07,53.65 IC1.30
  Bottom 0.406: v111.25,54.56 115.82,54.56 118.87,51.51 123.14,51.51 IC5.1
N$25
  Bottom 0.406: IC2.30 100.58,53.34 116.13,53.34 119.48,49.99 127.1,49.99 128.32,51.21 IC5.3
N$26
  Bottom 0.406: IC9.4 117.96,17.98 124.05,24.08 124.05,38.1 125.58,39.62 IC10.2
N$27
  Bottom 0.406: IC8.6 131.37,15.85 128.63,18.59 128.63,39.62 IC10.3
N$28  (via drill 0.51)
  Top 0.406: v69.19,45.72 58.83,45.72 IC1.14 | v120.09,42.98 127.71,42.98 130.76,39.93 IC10.4 131.06,39.62 132.89,37.8 135.03,37.8 v138.38,34.44
  Bottom 0.406: v69.19,45.72 72.85,42.06 117.35,42.06 118.26,42.98 v120.09,42.98 | v138.38,34.44 140.21,32.61 140.21,26.82 139.29,25.91 IC8.15
N$29  (via drill 0.51)
  Top 0.406: v121.61,44.5 128.63,44.5 133.2,39.93 IC10.5 133.5,39.62 134.72,38.41 135.94,38.41 v140.82,33.53
  Bottom 0.406: v121.61,44.5 99.67,44.5 98.45,45.72 85.34,45.72 IC2.14 | v140.82,33.53 140.82,24.99 139.29,23.47 IC8.14
N$30
  Bottom 0.406: IC2.15 85.04,43.28 85.04,43.89 84.12,44.81 84.12,57.3 85.04,58.22 IC2.9
N$31  (via drill 0.51)
  Top 0.406: v50.6,57.3 67.97,57.3 73.15,52.12 83.82,52.12 85.04,53.34 IC2.11
  Bottom 0.406: v50.6,57.3 38.1,69.8 IC6.11
N$32
  Bottom 0.406: IC6.10 40.54,70.1 40.54,74.07 47.24,80.77 86.56,80.77 98.75,68.58 98.75,60.05 100.28,58.52 IC2.32
N$33
  Bottom 0.406: IC7.11 38.1,91.14 47.85,81.38 86.87,81.38 99.36,68.89 99.36,62.18 100.28,61.27 IC2.33
N$34  (via drill 0.51)
  Top 0.406: v71.63,92.66 36.58,92.66 35.36,91.44 IC7.12
  Bottom 0.406: v71.63,92.66 79.86,92.66 98.75,73.76 100.28,73.76 IC2.38
N$35
  Bottom 0.406: IC7.9 42.98,91.44 67.97,91.44 70.71,94.18 86.26,94.18 100.28,80.16 101.5,80.16 101.8,79.86 101.8,72.54 100.58,71.32 IC2.37
N$36
  Bottom 0.406: IC6.9 42.98,69.8 67.67,69.8 72.85,74.98 74.68,74.98 82.6,67.06 82.6,61.57 84.43,59.74 86.26,59.74 86.56,59.44 86.56,57.3 85.34,56.08 IC2.10
N$37  (via drill 0.51)
  Top 0.406: v46.63,71.02 36.88,71.02 35.97,70.1 35.36,70.1 IC6.12 | v96.93,68.89 100.28,68.89 IC2.36
  Bottom 0.406: v46.63,71.02 48.77,71.02 57.91,80.16 86.26,80.16 96.93,69.49 v96.93,68.89
N$38
  Top 0.406: C9.+ 25.11,57.65 IC6.1
N$39  (via drill 0.51)
  Top 0.406: v83.52,65.84 74.07,65.84 IC1.35 | v129.54,60.35 129.54,57.91 135.94,51.51 IC5.6
  Bottom 0.406: v83.52,65.84 84.43,64.92 92.05,64.92 99.67,57.3 101.5,57.3 101.8,57.61 101.8,60.35 | 101.8,60.35 101.8,64.62 100.58,65.84 IC2.35 | 101.8,60.35 v129.54,60.35
N$40
  Top 0.406: IC6.4 33.46,61.46 C10.+
N$41
  Top 0.406: IC6.5 38.54,58.92 C10.-
N$42
  Top 0.406: IC6.6 42.46,57.54 C12.-
N$43
  Bottom 0.406: C11.+ 20.64,57.1 20.64,57.15 23.81,60.33 26.35,60.33 27.65,61.62 IC6.2
N$44
  Top 0.406: IC7.3 30.19,80.14 C13.-
N$45
  Top 0.406: IC7.1 23.46,82.03 C13.+
N$46
  Top 0.406: IC7.4 32.73,78.76 C14.+
N$47
  Top 0.406: IC7.5 37.54,81.41 C14.-
N$48
  Top 0.406: C16.- 37.81,83.14 IC7.6
N$49
  Bottom 0.406: C15.+ 22.96,81.92 26.35,81.92 27.65,83.21 IC7.2
N$50
  Top 0.406: IC2.16 85.23,40.73 83.82,39.32 60.02,39.32 IC1.16
  Bottom 0.406: QG1.8 98.45,19.2 98.45,27.43 85.34,40.54 IC2.16
RTS0
  Bottom 0.406: IC3.7 40.35,19.09 39.88,19.56 33.53,19.56 31.5,21.59 31.5,26.92 29.97,28.45 6.25,28.45 X1.7
RTS1
  Bottom 0.406: IC6.7 34.04,68.5 34.04,73.66 33.43,74.27 X2.7
RX0
  Bottom 0.406: IC3.8 42.89,19.59 41.91,20.57 35.05,20.57 34.04,21.59 34.04,27.94 32.26,29.72 8.69,29.72 X1.2
RX1
  Bottom 0.406: IC6.8 36.58,68.5 36.58,74.93 35.87,75.64 X2.2
TX0
  Bottom 0.406: IC3.14 30.19,25.44 28.7,26.92 X1.3
TX1
  Bottom 0.406: IC6.14 30.19,71.92 29.21,72.9 X2.3

### Text on the board
_tsilk: 1 | IC11 | RN1 | MAX232 | 74LS245N | IC7 | IC1 | IC2 | 16C550 | 16C550 | MAX232 | IC6 | UART1 | 74LS04N | IC5 | 74LS08N | MAX232 | IC10 | IC4 | IC8 | IC9 | 74LS138N | 74LS02N | QG1 | MAX232 | IC3 | 1.8432MHz | UART0 | 1 | UART v1.0.3, (C) D.Pilawa, 05.2012